# Altium schematic sheet Nucleo_Connector.SchDoc
size A4; MPS_Contact: www.monolithicpower.com
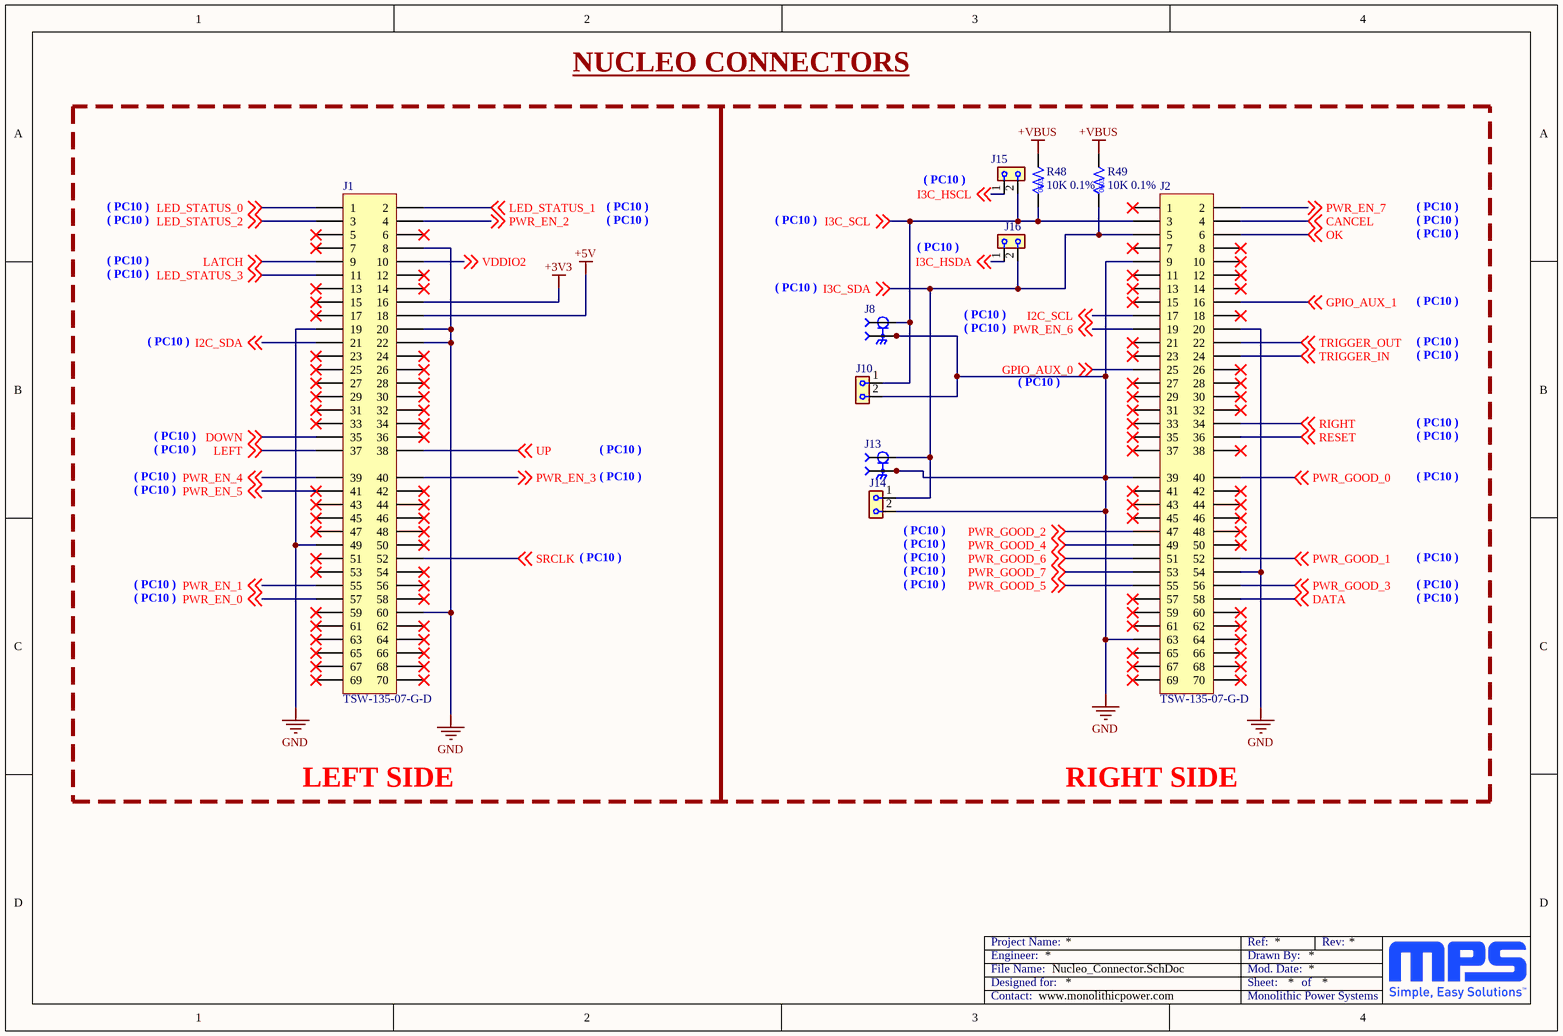
[diagram p0: Nucleo_Connector.SchDoc]

## Parts
J1  TSW-135-07-G-D  [CON_SAMTEC_TSW-135-07-X-D]
J2  TSW-135-07-G-D  [CON_SAMTEC_TSW-135-07-X-D]
J8  MMCX-J-P-H-ST-TH1  [SAMTEC_MMCX-J-P-H-ST-TH1]  (value not drawn)
J10  TSW-102-07-F-S  [HEADER/VERT/1X2/M/P2.54]  (value not drawn)
J13  MMCX-J-P-H-ST-TH1  [SAMTEC_MMCX-J-P-H-ST-TH1]  (value not drawn)
J14  TSW-102-07-F-S  [HEADER/VERT/1X2/M/P2.54]  (value not drawn)
J15  TSW-102-07-F-S  [HEADER/VERT/1X2/M/P2.54]  (value not drawn)
J16  TSW-102-07-F-S  [HEADER/VERT/1X2/M/P2.54]  (value not drawn)
R48  10K 0.1%  [CC/NM 0603]
R49  10K 0.1%  [CC/NM 0603]

## Nets
+3V3: J1.16
+5V: J1.18
+VBUS: R48.2 R49.2
GND: J1.8 J1.19 J1.20 J1.22 J1.49 J1.60 J2.9 J2.20 J2.39 J2.54 J2.63 J8.S1 J8.S2 J8.S3 J8.S4 J10.2 J13.S1 J13.S2 J13.S3 J13.S4 J14.2
CANCEL: J2.4 ; off-sheet CANCEL
DATA: J2.58 ; off-sheet DATA
DOWN: J1.35 ; off-sheet DOWN
GPIO_AUX_0: J2.25 ; off-sheet GPIO_AUX_0
GPIO_AUX_1: J2.16 ; off-sheet GPIO_AUX_1
I2C_SCL: J2.17 ; off-sheet I2C_SCL
I2C_SDA: J1.21 ; off-sheet I2C_SDA
I3C_HSCL: J15.1 ; off-sheet I3C_HSCL
I3C_HSDA: J16.1 ; off-sheet I3C_HSDA
I3C_SCL: J2.3 J8.1 J10.1 J15.2 R48.1 ; off-sheet I3C_SCL
I3C_SDA: J2.5 J13.1 J14.1 J16.2 R49.1 ; off-sheet I3C_SDA
LATCH: J1.9 ; off-sheet LATCH
LED_STATUS_0: J1.1 ; off-sheet LED_STATUS_0
LED_STATUS_1: J1.2 ; off-sheet LED_STATUS_1
LED_STATUS_2: J1.3 ; off-sheet LED_STATUS_2
LED_STATUS_3: J1.11 ; off-sheet LED_STATUS_3
LEFT: J1.37 ; off-sheet LEFT
OK: J2.6 ; off-sheet OK
PWR_EN_0: J1.57 ; off-sheet PWR_EN_0
PWR_EN_1: J1.55 ; off-sheet PWR_EN_1
PWR_EN_2: J1.4 ; off-sheet PWR_EN_2
PWR_EN_3: J1.40 ; off-sheet PWR_EN_3
PWR_EN_4: J1.39 ; off-sheet PWR_EN_4
PWR_EN_5: J1.41 ; off-sheet PWR_EN_5
PWR_EN_6: J2.19 ; off-sheet PWR_EN_6
PWR_EN_7: J2.2 ; off-sheet PWR_EN_7
PWR_GOOD_0: J2.40 ; off-sheet PWR_GOOD_0
PWR_GOOD_1: J2.52 ; off-sheet PWR_GOOD_1
PWR_GOOD_2: J2.47 ; off-sheet PWR_GOOD_2
PWR_GOOD_3: J2.56 ; off-sheet PWR_GOOD_3
PWR_GOOD_4: J2.49 ; off-sheet PWR_GOOD_4
PWR_GOOD_5: J2.55 ; off-sheet PWR_GOOD_5
PWR_GOOD_6: J2.51 ; off-sheet PWR_GOOD_6
PWR_GOOD_7: J2.53 ; off-sheet PWR_GOOD_7
RESET: J2.36 ; off-sheet RESET
RIGHT: J2.34 ; off-sheet RIGHT
SRCLK: J1.52 ; off-sheet SRCLK
TRIGGER_IN: J2.24 ; off-sheet TRIGGER_IN
TRIGGER_OUT: J2.22 ; off-sheet TRIGGER_OUT
UP: J1.38 ; off-sheet UP
VDDIO2: J1.10 ; off-sheet VDDIO2

Not connected (* = marked no-connect by the designer): J1 5* 6* 7* 12* 13* 14* 15* 17* 23* 24* 25* 26* 27* 28* 29* 30* 31* 32* 33* 34* 36* 42* 43* 44* 45* 46* 47* 48* 50* 51* 53* 54* 56* 58* 59* 61* 62* 63* 64* 65* 66* 67* 68* 69* 70*; J2 1* 7* 8* 10* 11* 12* 13* 14* 15* 18* 21* 23* 26* 27* 28* 29* 30* 31* 32* 33* 35* 37* 38* 41* 42* 43* 44* 45* 46* 48* 50* 57* 59* 60* 61* 62* 64* 65* 66* 67* 68* 69* 70*

## Notes on the sheet
- NUCLEO CONNECTORS
- ( PC10 )
- (near J16) ( PC10 )
- (near J15) ( PC10 )
- (near J8) ( PC10 )
- (near J14) ( PC10 )
- LEFT SIDE
- RIGHT SIDE
- Engineer:
- Designed for:
- File Name:
- Project Name:
- Mod. Date:
- Sheet:
- Drawn By:
- Ref:
- of
- Rev:
- Contact:
- Monolithic Power Systems

## Library data of the parts
J1 J2 = TSW-135-07-G-D: Header, 35x2, 2,54mm, VR, TH, Height 5.84mm/2.54mm; Manufacturer: Samtec; DrownBy: Xavier Rocher; Package: 0603; Supplier 1: Farnell; Supplier  Part Number 1: 3664498; Supplier 2: Mouser; Supplier  Part Number 2: 200-TSW13507GD; Manufacturer Part Number: TSW-135-07-G-D; Value: TSW-135-07-G-D
J8 J13 = MMCX-J-P-H-ST-TH1: RF Connectors / Coaxial Connectors 50 OHM MMCX JACK OR PLUG; Manufacturer: Samtec Inc.; DrownBy: Xavier Rocher; Datasheet: https://mm.digikey.com/Volume0/opasdata/d220001/medias/docus/6129/mmcx-j-p-x-st-th1-mkt.pdf; Package: 0603; Supplier 1: Digikey; Supplier  Part Number 1: SAM10617-ND; Supplier 2: Mouser; Supplier  Part Number 2: 200-MMCXJPHSTTH1; Manufacturer Part Number: MMCX-J-P-H-ST-TH1; Value: MMCX-J-P-H-ST-TH1
J10 J14-J16 = TSW-102-07-F-S: Alojamientos de cables y cabecera 2.54MM CLASSIC PCB HDR STRIP; Manufacturer: SAMTEC; DrownBy: Xavier Rocher; Datasheet: https://www.farnell.com/datasheets/1701645.pdf?_gl=1*1o3ly18*_gcl_aw*R0NMLjE3NzI0NTg0MDAuQ2p3S0NBaUFoNVhOQmhBQUVpd0FfQnU4RlFpaGh0aTJCR0F1SXBlQ2pXMWtFYmlZc2JraDRpajgydjZyT2lxVUUtZHBLLW80X0NoNy1Sb0NSZjhRQXZEX0J3RQ..*_gcl_au*MjEwMjY0Mzg0MC4xNzcyNDM5MTYx; Package: 0603; Supplier 1: Farnell; Supplier  Part Number 1: 2779661; Supplier 2: Mouser; Supplier  Part Number 2: 200-TSW10207FS; Manufacturer Part Number: TSW-102-07-F-S; Value: TSW-102-07-F-S
R48 R49 = CRT0603-BY-1002ELF: Thin Film Resistors - SMD 1/10watts 10K .1%; Manufacturer: Bourns; DrownBy: Xavier Rocher; Datasheet: https://4donline.ihs.com/images/VipMasterIC/IC/VISH/VISH-S-A0025054536/VISH-S-A0025054537-1.pdf?hkey=6D3A4C79FDBF58556ACFDE234799DDF0; Package: 0603; Supplier 1: Farnell; Supplier  Part Number 1: 2008310; Supplier 2: Mouser; Supplier  Part Number 2: 652-CRT0603BY1002ELF; Manufacturer Part Number: CRT0603-BY-1002ELF; Automotive: Yes; Value: 10K 0.1%